# EAGLE design PB_LAN9500 (EAGLE 7.7.0)

## Sheet 1 of 3
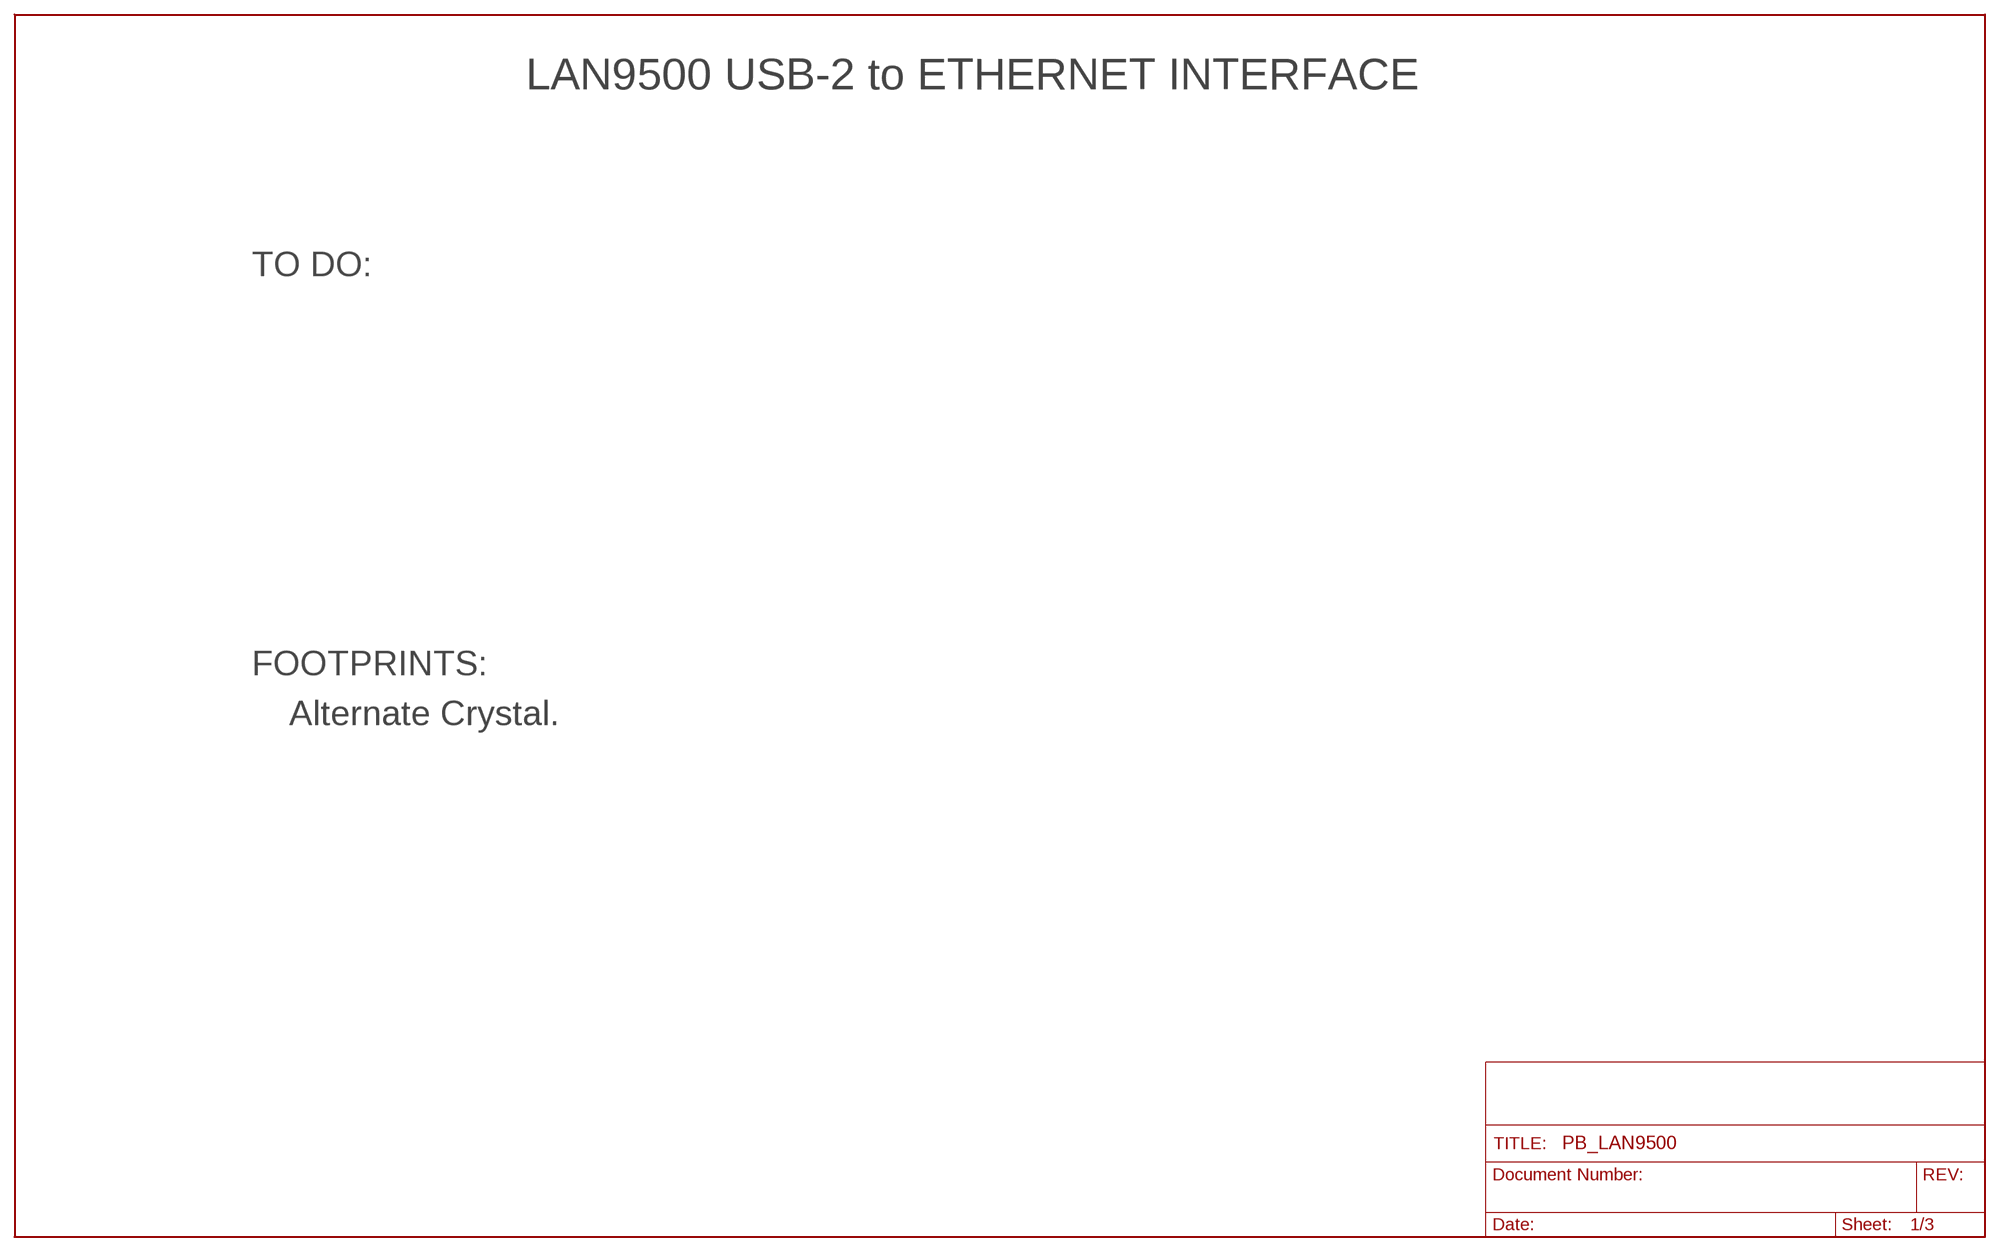
[diagram p0: schematic, sheet 1]

### Notes on the sheet
- LAN9500 USB-2 to ETHERNET INTERFACE
- TO DO:
- FOOTPRINTS:
- Alternate Crystal.

## Sheet 2 of 3
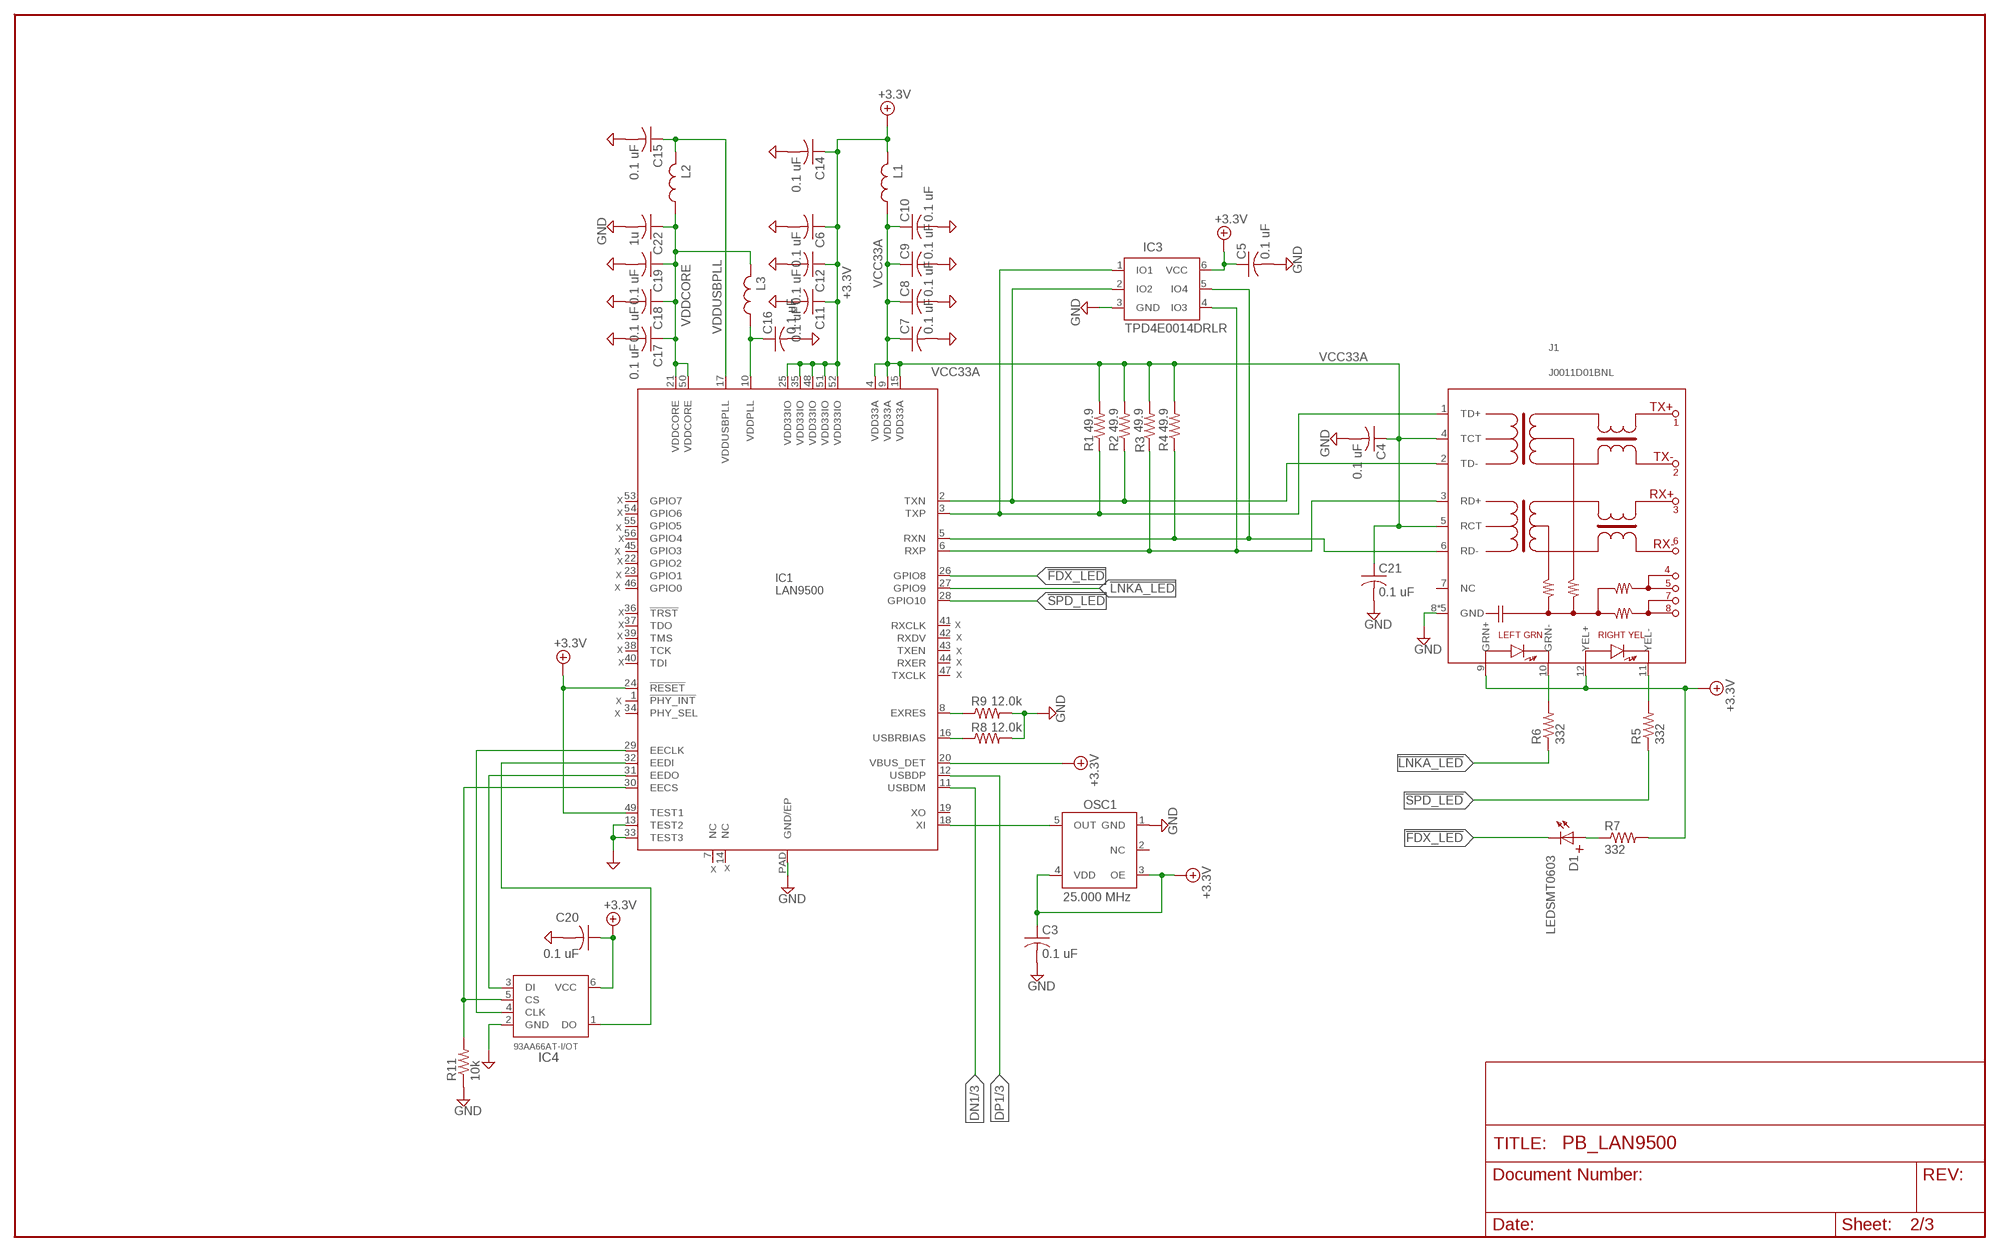
[diagram p1: schematic, sheet 2]

### Parts
C3  0.1 uF  C-USC0402  [C0402]
C4  0.1 uF  C-USC0402  [C0402]
C5  0.1 uF  C-USC0402  [C0402]
C6  0.1 uF  C-USC0402  [C0402]
C7  0.1 uF  C-USC0402  [C0402]
C8  0.1 uF  C-USC0402  [C0402]
C9  0.1 uF  C-USC0402  [C0402]
C10  0.1 uF  C-USC0402  [C0402]
C11  0.1 uF  C-USC0402  [C0402]
C12  0.1 uF  C-USC0402  [C0402]
C14  0.1 uF  C-USC0402  [C0402]
C15  0.1 uF  C-USC0402  [C0402]
C16  0.1 uF  C-USC0402  [C0402]
C17  0.1 uF  C-USC0402  [C0402]
C18  0.1 uF  C-USC0402  [C0402]
C19  0.1 uF  C-USC0402  [C0402]
C20  0.1 uF  C-USC0402  [C0402]
C21  0.1 uF  C-USC0402  [C0402]
C22  1u  C-USC0805  [C0805]
D1  LEDSMT0603  [LED0603]
IC1  LAN9500  [QFN56]
IC3  TPD4E0014DRLR  [SOT-553-6]
IC4  93AA66AT-I/OT  [SOT23-6]
J1  J0011D01BNL  [J0011D01BNL]
L1  L0603AS  [L0603AS]
L2  L0603AS  [L0603AS]
L3  L0603AS  [L0603AS]
OSC1  25.000 MHz  SIT2024B  [SOT23-5]
R1  49.9  R-US_R0603  [R0603]
R2  49.9  R-US_R0603  [R0603]
R3  49.9  R-US_R0603  [R0603]
R4  49.9  R-US_R0603  [R0603]
R5  332  R-US_R0603  [R0603]
R6  332  R-US_R0603  [R0603]
R7  332  R-US_R0603  [R0603]
R8  12.0k  R-US_R0603  [R0603]
R9  12.0k  R-US_R0603  [R0603]
R11  10k  R-US_R0603  [R0603]

### Nets
!FDX_LED: D1.P$2(K) IC1.26(GPIO8)
!LNKA_LED: IC1.27(GPIO9) R6.1
!SPD_LED: IC1.28(GPIO10) R5.1
+3.3V: C3.1 C5.1 C6.1 C11.1 C12.1 C14.1 C20.1 IC1.20(VBUS_DET) IC1.24(!RESET) IC1.25(VDD33IO) IC1.35(VDD33IO) IC1.48(VDD33IO) IC1.49(TEST1) IC1.51(VDD33IO) IC1.52(VDD33IO) IC3.6(VCC) IC4.6(VCC) J1.9(GRN+) J1.12(YEL+) L1.2 OSC1.3(OE) OSC1.4(VDD) R7.2 ; also sheet 3
DN1: IC1.11(USBDM) ; also sheet 3
DP1: IC1.12(USBDP) ; also sheet 3
GND: C3.2 C4.2 C5.2 C6.2 C7.2 C8.2 C9.2 C10.2 C11.2 C12.2 C14.2 C15.2 C16.2 C17.2 C18.2 C19.2 C20.2 C21.2 C22.2 IC1.13(TEST2) IC1.33(TEST3) IC1.PAD(GND/EP) IC3.3(GND) IC4.2(GND) J1.8(GND) J1.GND1(GND) J1.GND2(GND) J1.GND3(GND) J1.GND4(GND) OSC1.1(GND) R8.2 R9.2 R11.1 ; also sheet 3
N$3: J1.11(YEL-) R5.2
N$5: IC1.30(EECS) IC4.5(CS) R11.2
N$6: IC1.29(EECLK) IC4.4(CLK)
N$7: IC1.31(EEDO) IC4.3(DI)
N$8: IC1.32(EEDI) IC4.1(DO)
N$9: IC1.8(EXRES) R9.1
N$10: IC1.16(USBRBIAS) R8.1
N$14: D1.P$1(A) R7.1
N$18: J1.10(GRN-) R6.2
N$22: IC1.18(XI) OSC1.5(OUT)
RXN: IC1.5(RXN) IC3.5(IO4) J1.6(RD-) R4.1
RXP: IC1.6(RXP) IC3.4(IO3) J1.3(RD+) R3.1
TXN: IC1.2(TXN) IC3.2(IO2) J1.2(TD-) R2.1
TXP: IC1.3(TXP) IC3.1(IO1) J1.1(TD+) R1.1
VCC33A: C4.1 C7.1 C8.1 C9.1 C10.1 C21.1 IC1.4(VDD33A) IC1.9(VDD33A) IC1.15(VDD33A) J1.4(TCT) J1.5(RCT) L1.1 R1.2 R2.2 R3.2 R4.2
VDDCORE: C17.1 C18.1 C19.1 C22.1 IC1.21(VDDCORE) IC1.50(VDDCORE) L2.1 L3.2
VDDPLL: C16.1 IC1.10(VDDPLL) L3.1
VDDUSBPLL: C15.1 IC1.17(VDDUSBPLL) L2.2
Unconnected: IC1.1(!PHY_INT) IC1.7(NC) IC1.14(NC) IC1.19(XO) IC1.22(GPIO2) IC1.23(GPIO1) IC1.34(PHY_SEL) IC1.36(!TRST) IC1.37(TDO) IC1.38(TCK) IC1.39(TMS) IC1.40(TDI) IC1.41(RXCLK) IC1.42(RXDV) IC1.43(TXEN) IC1.44(RXER) IC1.45(GPIO3) IC1.46(GPIO0) IC1.47(TXCLK) IC1.53(GPIO7) IC1.54(GPIO6) IC1.55(GPIO5) IC1.56(GPIO4) J1.7(NC) OSC1.2(NC)

### Notes on the sheet
- X
- X
- X
- X
- X
- X
- X
- X
- X
- X | X
- X | X
- X | X
- X | X
- X
- X
- X
- X | X

## Sheet 3 of 3
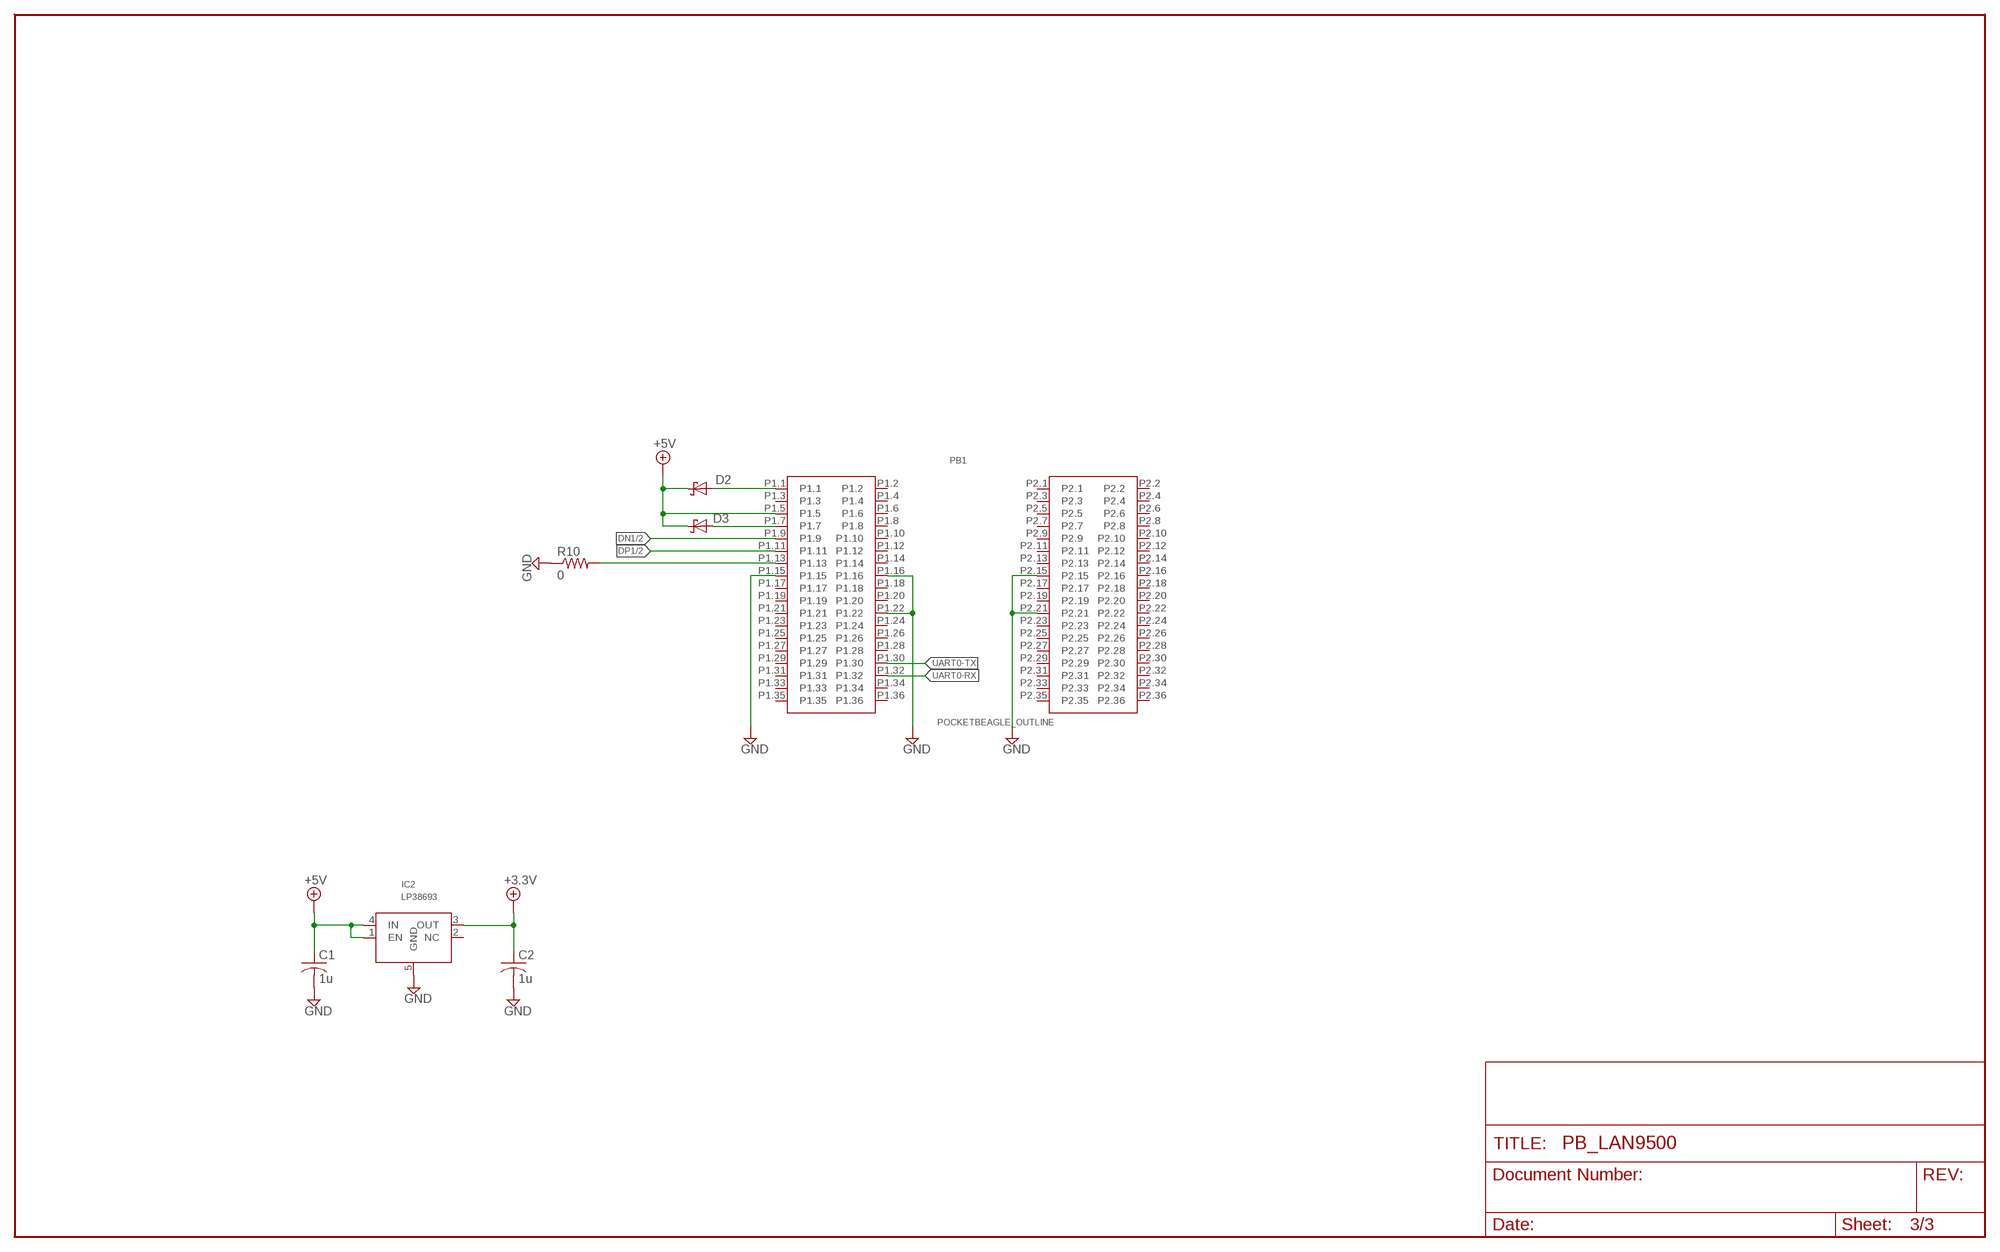
[diagram p2: schematic, sheet 3]

### Parts
C1  1u  C-USC0805  [C0805]
C2  1u  C-USC0805  [C0805]
D2  MBRAF1540  [SMA-FL]
D3  MBRAF1540  [SMA-FL]
IC2  LP38693  [SOT-223-4]
PB1  POCKETBEAGLE_OUTLINE  [PB_OUTLINE]
R10  0  R-US_R0603  [R0603]

### Nets
+3.3V: C2.1 IC2.3(OUT) ; also sheet 2
+5V: C1.1 D2.C D3.C IC2.1(EN) IC2.4(IN) PB1.P1.5
DN1: PB1.P1.9 ; also sheet 2
DP1: PB1.P1.11 ; also sheet 2
GND: C1.2 C2.2 IC2.5(GND) PB1.P1.15 PB1.P1.16 PB1.P1.22 PB1.P2.15 PB1.P2.21 R10.1 ; also sheet 2
ID1: PB1.P1.13 R10.2
N$1: D3.A PB1.P1.7
N$2: D2.A PB1.P1.1
UART0-RX: PB1.P1.32
UART0-TX: PB1.P1.30
Unconnected: IC2.2(NC) PB1.P1.2 PB1.P1.3 PB1.P1.4 PB1.P1.6 PB1.P1.8 PB1.P1.10 PB1.P1.12 PB1.P1.14 PB1.P1.17 PB1.P1.18 PB1.P1.19 PB1.P1.20 PB1.P1.21 PB1.P1.23 PB1.P1.24 PB1.P1.25 PB1.P1.26 PB1.P1.27 PB1.P1.28 PB1.P1.29 PB1.P1.31 PB1.P1.33 PB1.P1.34 PB1.P1.35 PB1.P1.36 PB1.P2.1 PB1.P2.2 PB1.P2.3 PB1.P2.4 PB1.P2.5 PB1.P2.6 PB1.P2.7 PB1.P2.8 PB1.P2.9 PB1.P2.10 PB1.P2.11 PB1.P2.12 PB1.P2.13 PB1.P2.14 PB1.P2.16 PB1.P2.17 PB1.P2.18 PB1.P2.19 PB1.P2.20 PB1.P2.22 PB1.P2.23 PB1.P2.24 PB1.P2.25 PB1.P2.26 PB1.P2.27 PB1.P2.28 PB1.P2.29 PB1.P2.30 PB1.P2.31 PB1.P2.32 PB1.P2.33 PB1.P2.34 PB1.P2.35 PB1.P2.36

## Library data of the parts
C1-C12 C14-C22 = 0G_RCL:C-US: CAPACITOR, American symbol
D1 = 0G_LED_TVS:LED: LiteOn LEDS, SMT 0805, 0603, T-1 Leaded Package
D2 D3 = 0G_Diode:MBRAF1540: ON Semiconductor MBRAF1540 Schottky
IC1 = 0G_Ethernet:LAN9500: MICROCHIO SMSC LAN9500 USB-2 TO ETHERNET 10/100b
IC2 = 0G_Regulators:LP38693: TI LP38693 Fixed Voltage LDO, SOT-223 Package
IC3 = 0G_Ethernet:TPD4E001: TI Low-Capacitance +/- 15 kV ESD Protection Array for High Speed Data Interfaces
IC4 = 0G_Ethernet:93AA66A
J1 = 0G_Ethernet:J0011D01BNL: PulseJack J0011D01BNL Ethernet Connector with internal magnetics
L1-L3 = 0G_Ethernet:L0603AS: 0603AS sized chip inductors
OSC1 = 0G_Oscillators:SIT2024B: SiTime SOT23 Oscillator
PB1 = 0G_PockletBeagle:POCKETBEAGLE_OUTLINE: PocketBeagle Outline and IO Connectors, Unlabled
R1-R11 = 0G_Passives:R-US_: RESISTOR, American symbol

## Board
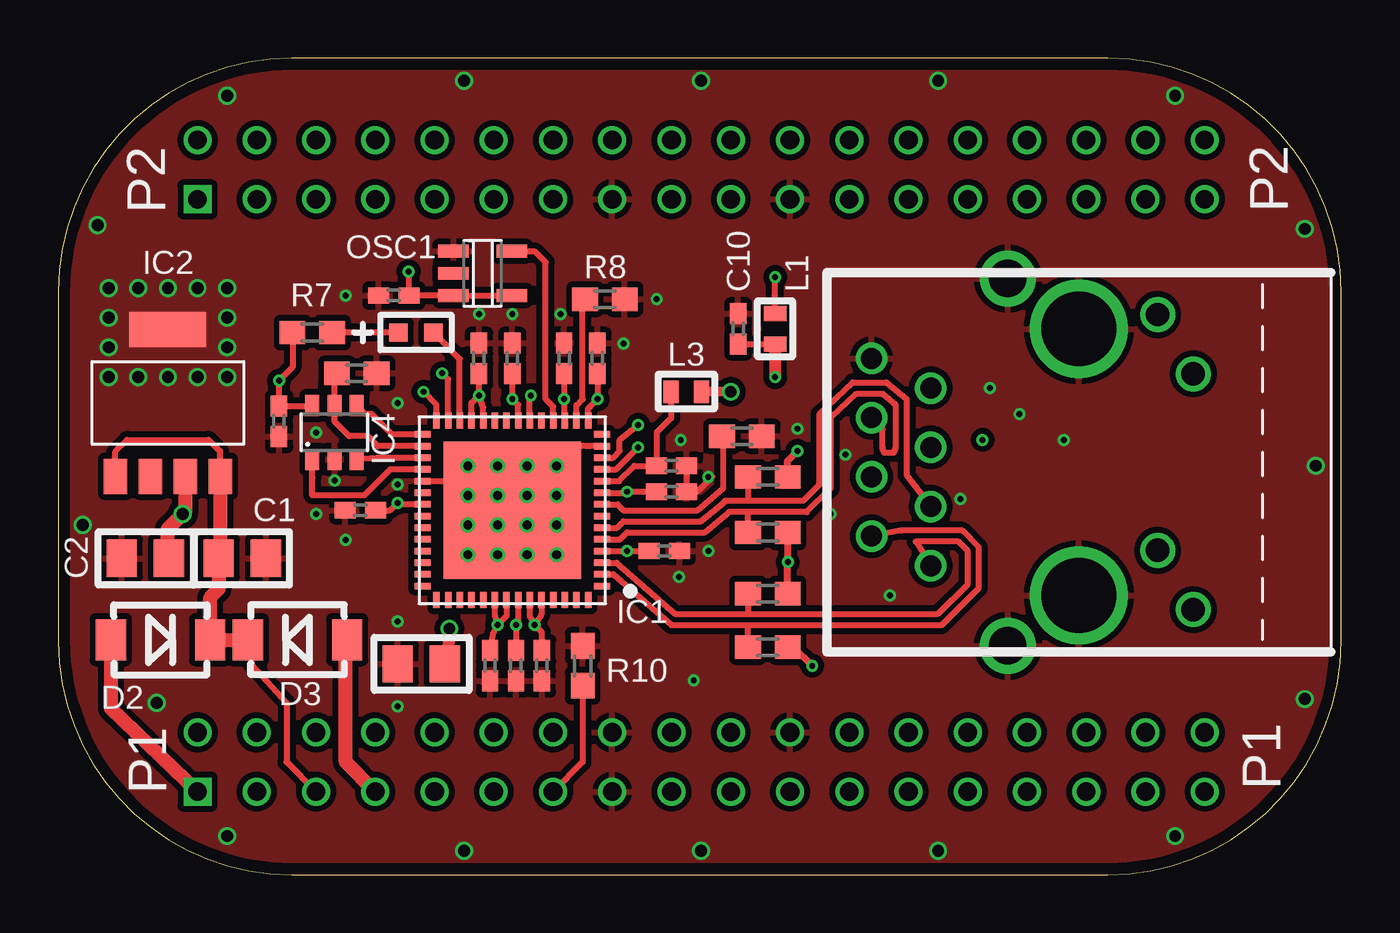
[diagram p3: board, top side]
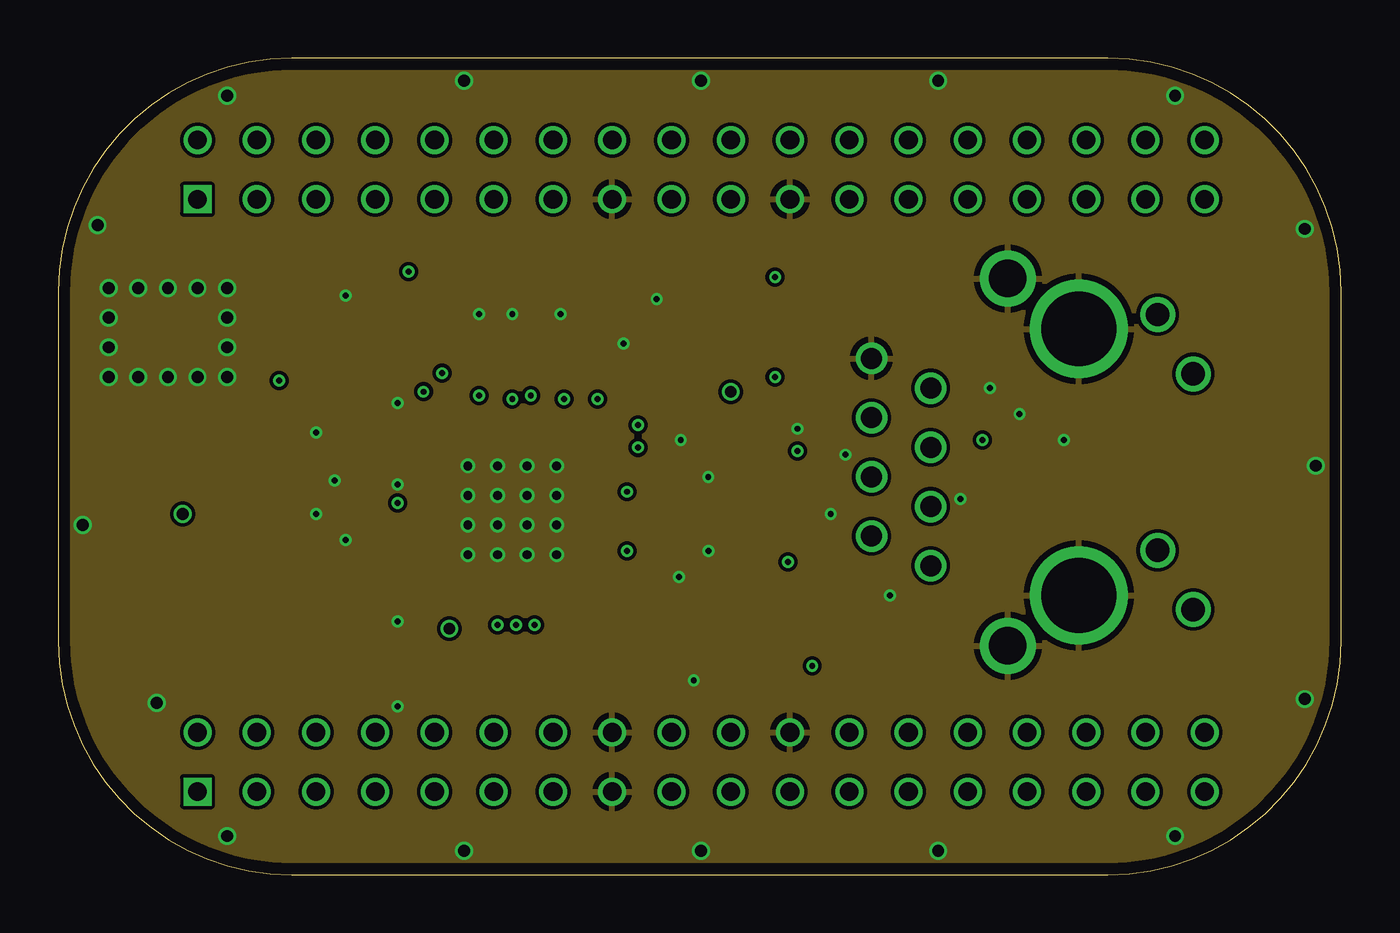
[diagram p4: board, inner layer GND]
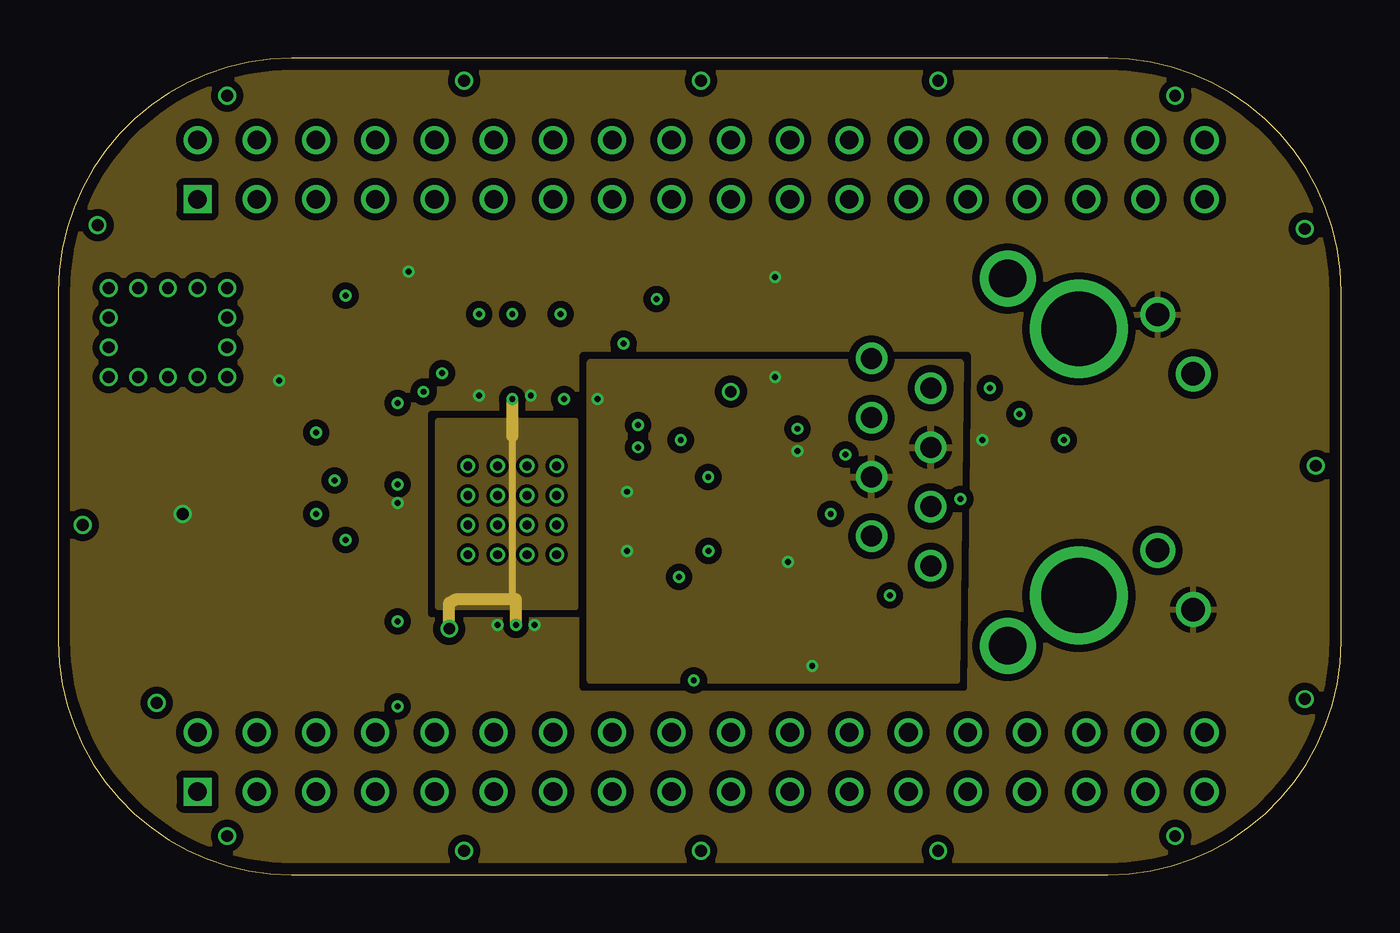
[diagram p5: board, inner layer POWER]
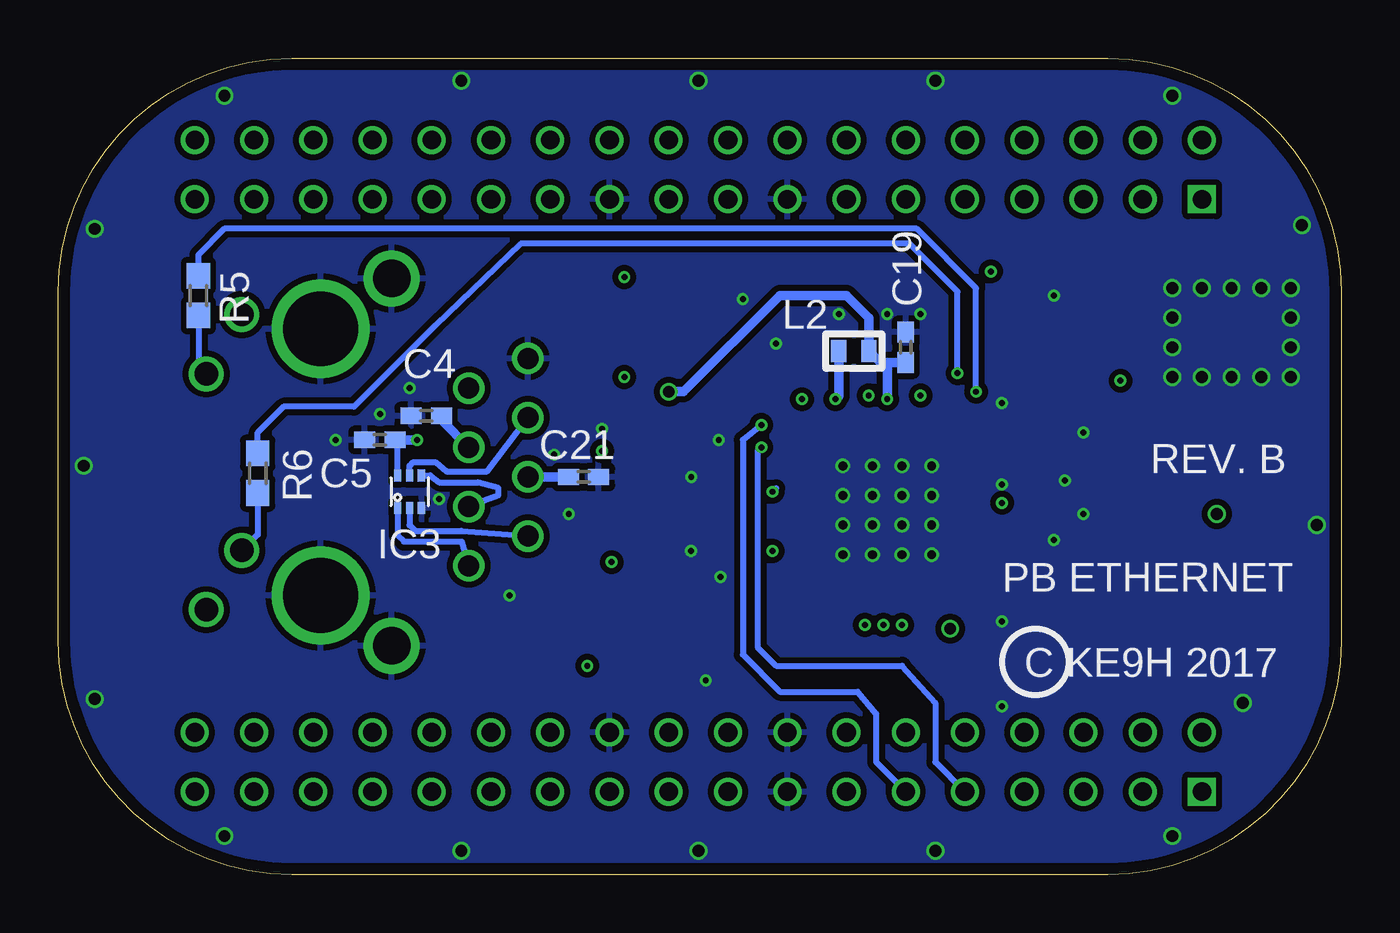
[diagram p6: board, bottom side, seen from below]

Size 55 x 35 mm. Coordinates in mm from the lower left corner, seen from the top.
Copper layers (1*2+15*16): TOP 0.035mm / dielectric 0.16mm / GND 0.035mm / dielectric 1.2mm / POWER 0.035mm / dielectric 0.16mm / BOTTOM 0.035mm
Design rules "default *": minimum track width 8mil, minimum drill 10mil, track to track 6mil, track to pad 6mil, pad to pad 6mil, via to via 6mil, smd to smd 6mil, copper to edge 20mil, drill to drill 8mil, minimum pad ring 5mil, minimum via ring 5mil, stop-mask expansion 4mil, vias tented up to drill 0mil, thermal gap 10mil
tRestrict: area 16.3,15.1 to 16.6,16.1; area 22.3,15.1 to 22.6,16.1; area 19,18.5 to 19.9,18.8; area 19,12.4 to 19.9,12.8

### Footprints (pad centres in the part's own frame; a part is rotated, then mirrored left to right if it is on the bottom)
C0805 = smd 1.295 x 1.6: 1 -1.001,0; 2 1.026,0
C0402 = smd 0.9 x 0.7: 1 -0.65,0; 2 0.65,0
LED0603 = smd 0.787 x 0.787: P$1 -0.749,0; P$2 0.749,0
SMA-FL = smd 1.3 x 1.76: A -2.13,0; C 2.13,0
QFN56 = smd 0.28 x 0.69: 1 -3.25,-3.845; 2 -2.75,-3.845; 3 -2.25,-3.845; 4 -1.75,-3.845; 5 -1.25,-3.845; 6 -0.75,-3.845; 7 -0.25,-3.845; 8 0.25,-3.845; 9 0.75,-3.845; 10 1.25,-3.845; 11 1.75,-3.845; 12 2.25,-3.845; 13 2.75,-3.845; 14 3.25,-3.845; 29 3.25,3.845; 30 2.75,3.845; 31 2.25,3.845; 32 1.75,3.845; 33 1.25,3.845; 34 0.75,3.845; 35 0.25,3.845; 36 -0.25,3.845; 37 -0.75,3.845; 38 -1.25,3.845; 39 -1.75,3.845; 40 -2.25,3.845; 41 -2.75,3.845; 42 -3.25,3.845 | smd 0.69 x 0.28: 15 3.845,-3.25; 16 3.845,-2.75; 17 3.845,-2.25; 18 3.845,-1.75; 19 3.845,-1.25; 20 3.845,-0.75; 21 3.845,-0.25; 22 3.845,0.25; 23 3.845,0.75; 24 3.845,1.25; 25 3.845,1.75; 26 3.845,2.25; 27 3.845,2.75; 28 3.845,3.25; 43 -3.845,3.25; 44 -3.845,2.75; 45 -3.845,2.25; 46 -3.845,1.75; 47 -3.845,1.25; 48 -3.845,0.75; 49 -3.845,0.25; 50 -3.845,-0.25; 51 -3.845,-0.75; 52 -3.845,-1.25; 53 -3.845,-1.75; 54 -3.845,-2.25; 55 -3.845,-2.75; 56 -3.845,-3.25 | smd 5.9 x 5.9: PAD 0,0
SOT-223-4 = smd 1 x 1.5: 1 -2.25,-3.15; 2 -0.75,-3.15; 3 0.75,-3.15; 4 2.25,-3.15 | smd 3.3 x 1.5: 5 0,3.15
SOT-553-6 = smd 0.305 x 0.508: 1 -0.508,-0.699; 2 0,-0.699; 3 0.508,-0.699; 4 0.508,0.699; 5 0,0.699; 6 -0.508,0.699
SOT23-6 = smd 0.6 x 0.9: 1 -0.95,-1.15; 2 0,-1.15; 3 0.95,-1.15; 4 0.95,1.15; 5 0,1.15; 6 -0.95,1.15
J0011D01BNL = drill 0.9: 1 4.445,-6.35; 2 3.175,-8.89; 3 1.905,-6.35; 4 0.635,-8.89; 5 -0.635,-6.35; 6 -1.905,-8.89; 7 -3.175,-6.35; 8 -4.445,-8.89 | drill 1: 9 6.325,4.902; 10 3.785,3.378; 11 -3.785,4.902; 12 -6.325,3.378 | drill 3.2: GND1 5.715,0; GND2 -5.715,0 | drill 1.6: GND3 7.874,-3.048; GND4 -7.874,-3.048
L0603AS = smd 0.65 x 0.95: 1 -0.65,0; 2 0.65,0
SOT23-5 = smd 0.55 x 1.3: 1 -0.95,-1.25; 2 0,-1.25; 3 0.95,-1.25; 4 0.95,1.25; 5 -0.95,1.25
PB_OUTLINE = drill 0.8 square: P1.1 -21.59,-13.97; P2.1 -21.59,11.43 | drill 0.8: P1.2 -21.59,-11.43; P1.3 -19.05,-13.97; P1.4 -19.05,-11.43; P1.5 -16.51,-13.97; P1.6 -16.51,-11.43; P1.7 -13.97,-13.97; P1.8 -13.97,-11.43; P1.9 -11.43,-13.97; P1.10 -11.43,-11.43; P1.11 -8.89,-13.97; P1.12 -8.89,-11.43; P1.13 -6.35,-13.97; P1.14 -6.35,-11.43; P1.15 -3.81,-13.97; P1.16 -3.81,-11.43; P1.17 -1.27,-13.97; P1.18 -1.27,-11.43; P1.19 1.27,-13.97; P1.20 1.27,-11.43; P1.21 3.81,-13.97; P1.22 3.81,-11.43; P1.23 6.35,-13.97; P1.24 6.35,-11.43; P1.25 8.89,-13.97; P1.26 8.89,-11.43; P1.27 11.43,-13.97; P1.28 11.43,-11.43; P1.29 13.97,-13.97; P1.30 13.97,-11.43; P1.31 16.51,-13.97; P1.32 16.51,-11.43; P1.33 19.05,-13.97; P1.34 19.05,-11.43; P1.35 21.59,-13.97; P1.36 21.59,-11.43; P2.2 -21.59,13.97; P2.3 -19.05,11.43; P2.4 -19.05,13.97; P2.5 -16.51,11.43; P2.6 -16.51,13.97; P2.7 -13.97,11.43; P2.8 -13.97,13.97; P2.9 -11.43,11.43; P2.10 -11.43,13.97; P2.11 -8.89,11.43; P2.12 -8.89,13.97; P2.13 -6.35,11.43; P2.14 -6.35,13.97; P2.15 -3.81,11.43; P2.16 -3.81,13.97; P2.17 -1.27,11.43; P2.18 -1.27,13.97; P2.19 1.27,11.43; P2.20 1.27,13.97; P2.21 3.81,11.43; P2.22 3.81,13.97; P2.23 6.35,11.43; P2.24 6.35,13.97; P2.25 8.89,11.43; P2.26 8.89,13.97; P2.27 11.43,11.43; P2.28 11.43,13.97; P2.29 13.97,11.43; P2.30 13.97,13.97; P2.31 16.51,11.43; P2.32 16.51,13.97; P2.33 19.05,11.43; P2.34 19.05,13.97; P2.35 21.59,11.43; P2.36 21.59,13.97
R0603 = smd 1.1 x 1: 1 -0.85,0; 2 0.85,0

### Placement (x,y rotation side)
C1  7.87,13.56 0 top
C2  3.75,13.56 180 top
C3  14.38,24.83 180 top
C4  39.23,19.67 180 bottom
C5  41.21,18.64 180 bottom
C6  18.51,8.95 270 top
C7  25.97,13.87 0 top
C8  26.29,16.41 0 top
C9  23.11,22.13 90 top
C10  29.15,23.4 90 top
C11  20.73,8.95 270 top
C12  12.95,15.62 180 top
C14  18.03,22.13 90 top
C15  21.69,22.13 90 top
C16  26.29,17.53 0 top
C17  19.62,8.95 270 top
C18  19.46,22.13 90 top
C19  18.67,22.61 90 bottom
C20  9.46,19.43 270 top
C21  32.48,17.05 0 bottom
C22  15.57,9.03 180 top
D1  15.34,23.24 0 top
D2  4.38,10.06 0 top
D3  10.26,10.06 180 top
IC1  19.46,15.62 90 top
IC2  4.7,20.22 0 top
IC3  39.94,16.41 0 bottom
IC4  11.84,18.95 0 top
J1  43.75,17.68 270 top
L1  30.73,23.4 90 top
L2  20.89,22.45 180 bottom
L3  26.92,20.7 0 top
OSC1  18.19,25.78 270 top
PB1  27.56,17.53 0 top
R1  30.42,12.05 0 top
R2  30.42,9.75 0 top
R3  30.42,17.05 0 top
R4  30.42,14.67 0 top
R5  48.99,24.83 270 bottom
R6  46.45,17.21 270 bottom
R7  10.89,23.24 180 top
R8  23.43,24.67 0 top
R9  29.31,18.8 0 top
R10  22.48,8.95 270 top
R11  12.8,21.49 180 top

### Tracks (layer width: path | path; a pad name or v marks a point on that pad's centre or on a via)
!FDX_LED
  TOP 0.254: IC1.26 17.21,22.11 D1.P$2
!LNKA_LED  (via drill 0.25)
  TOP 0.254: IC1.27 16.71,21.23 v16.45,21.49
  BOTTOM 0.254: v16.45,21.49 16.45,24.99 18.51,27.05 35.18,27.05 38.83,23.56 42.32,20.07 45.34,20.07 46.45,18.95 R6.1
!SPD_LED  (via drill 0.25)
  TOP 0.254: IC1.28 16.21,20.14 v15.65,20.7
  BOTTOM 0.254: v15.65,20.7 15.65,25.15 18.19,27.69 47.88,27.69 48.99,26.57 R5.1
+3.3V  (via drill 0.25, 0.51)
  TOP 0.254: 10.25,23.24 R7.2 10.04,21.76 v9.46,21.18 C20.1 10.87,20.08 IC4.6 | OSC1.4 OSC1.3 C3.1 15.02,24.84 v15.02,25.86 | IC1.35 14.77,15.87 v14.54,15.94 14.22,15.62 C12.1 | IC1.25 17.71,20.22 v18.03,20.54 | IC1.24 18.21,20.05 v18.03,20.54 | IC1.20 20.21,20.34 v20.26,20.54 | IC1.48 18.71,11.13 v18.83,10.7 | IC1.51 20.21,11.06 v20.41,10.7 | IC1.52 20.71,11.16 v20.41,10.7 | C11.1 20.73,10.38 v20.41,10.7 | C6.1 18.67,10.38 v18.83,10.7 | IC1.49 19.21,11.08 v18.83,10.7 | L1.2 v30.73,25.62 | v18.03,20.54 C14.1
  TOP 0.61: IC2.3 5.45,15.58 v5.33,15.46 4.7,14.83 4.7,13.83
  TOP 0.813: 4.7,13.83 C2.1
  BOTTOM 0.254: IC3.6 40.45,18.52 C5.1
  BOTTOM 0.406: C5.1 v39.62,18.64
  pour POWER (isolate 0.305, rank 2): -0.38,-0.25 -0.38,35.31 55.5,35.31 55.5,-0.25
+5V
  TOP 0.254: D3.C 8.28,9.02 9.78,7.37 9.78,4.83 PB1.P1.5 | IC2.1 2.45,18.13 2.95,18.64 6.44,18.64 6.92,18.16 6.92,17.1 IC2.4
  TOP 0.305: 6.6,17.1 IC2.4
  TOP 0.61: D3.C D2.C 6.51,11.88 6.87,12.24 C1.1 | 6.51,13.51 C1.1 | IC2.4 6.95,13.63 C1.1
  TOP 0.813: 6.63,13.63 C1.1
DN1  (via drill 0.25)
  TOP 0.254: IC1.11 23.91,17.37 v24.86,18.32
  BOTTOM 0.254: v24.86,18.32 25.02,18.16 25.02,9.75 24.23,8.95 18.83,8.95 17.4,7.37 17.4,4.83 PB1.P1.9
DP1  (via drill 0.25)
  TOP 0.254: IC1.12 23.78,17.87 24.07,18.16 24.07,18.64 v24.86,19.27
  BOTTOM 0.254: v24.86,19.27 25.65,18.64 25.65,9.43 24.07,7.84 20.73,7.84 19.94,6.89 19.94,4.83 PB1.P1.11
GND  (via drill 0.25, 0.38, 0.51)
  TOP 0.254: IC1.33 18.21,16.87 v17.56,16.26 | IC1.13 22.21,18.37 v21.37,17.53 | C16.2 C8.2 | 26.92,16.41 27.4,16.41 28.04,17.05
  TOP 0.508: v18.83,14.99 IC1.PAD
  other vias: 2.16,25.15 11.84,16.89 20.1,16.26 18.83,17.53 17.56,14.99 17.56,13.72 18.83,13.72 21.37,13.72 26.61,12.76 11.05,18.95 26.69,18.64 27.88,13.87 20.1,17.53 18.83,16.26 20.1,13.72 20.1,14.99 21.37,14.99 21.37,16.26 17.56,17.53 14.54,16.73 3.43,25.15 4.7,25.15 5.97,25.15 7.24,25.15 7.24,23.88 7.24,22.61 7.24,21.34 5.97,21.34 4.7,21.34 3.43,21.34 2.16,21.34 2.16,22.61 2.16,23.88 1.05,14.99 4.22,7.37 7.24,1.65 17.4,1.02 27.56,1.02 37.72,1.02 47.88,1.65 53.44,7.52 53.91,17.53 53.44,27.69 47.88,33.4 37.72,34.04 27.56,34.04 17.4,34.04 7.24,33.4 1.68,27.84 12.32,24.83 14.54,20.22 12.32,14.35 11.05,15.46 18.03,24.03 19.46,24.03 21.53,24.03 24.23,22.76 25.65,24.67 27.86,17.05 33.12,15.46 43.12,18.64 41.21,19.75 39.94,20.86 14.54,10.86 14.54,7.21 27.24,8.32 38.67,16.1 33.75,18 31.69,19.11 35.66,11.97
  pour BOTTOM (isolate 0.254): -0.38,-0.25 -0.38,35.31 55.5,35.31 55.5,-0.25
  pour TOP (isolate 0.254): -0.38,-0.25 -0.38,35.31 55.5,35.31 55.5,-0.25
  pour GND: -0.38,-0.25 -0.38,35.31 55.5,35.31 55.5,-0.25
ID1
  TOP 0.254: PB1.P1.13 22.48,4.83 R10.2
N$1
  TOP 0.61: PB1.P1.7 12.32,4.83 12.32,10 D3.A
N$2
  TOP 0.61: D2.A 2.25,7.11 PB1.P1.1
N$3
  BOTTOM 0.254: R5.2 48.99,21.81 J1.11
N$5
  TOP 0.254: IC1.30 13.7,18.37 13.27,18.8 12.48,18.8 11.84,19.43 IC4.5 11.84,21.39 R11.2
N$6
  TOP 0.254: IC1.29 14.31,18.87 13.43,19.75 13.15,19.75 IC4.4
N$7
  TOP 0.254: IC1.31 13.65,17.87 IC4.3
N$8
  TOP 0.254: IC1.32 14.23,17.37 13.11,16.26 10.89,16.26 10.89,17.01 IC4.1
N$9
  TOP 0.254: IC1.8 23.98,15.87 24.23,15.62 27.4,15.62 28.51,16.57 28.51,18.54 R9.1
N$10
  TOP 0.254: IC1.16 22.21,20.12 22.48,20.38 22.48,24.57 R8.1
N$14
  TOP 0.254: D1.P$1 R7.1
N$18
  BOTTOM 0.254: R6.2 46.45,14.58 J1.10
N$22
  TOP 0.254: IC1.18 21.21,20.06 20.89,20.38 20.89,26.26 20.42,26.73 OSC1.5
RXN
  TOP 0.254: IC1.5 24.09,14.37 24.38,14.67 27.72,14.67 27.74,14.69 28.67,15.46 28.75,15.54 29.62,15.54 | 29.62,15.54 32.08,15.54 33.12,16.57 33.12,19.59 34.23,20.62 35.34,20.62 35.89,20.14 35.89,18.32 35.81,18.08 35.42,18.08 35.34,18.32 35.34,19.11 J1.6 | R4.1 29.57,15.48 29.62,15.54
  BOTTOM 0.254: IC3.5 39.94,17.53 39.78,17.68 38.83,17.68 38.35,17.29 36.61,17.29 J1.6
RXP
  TOP 0.254: IC1.6 23.95,14.87 24.23,15.14 27.56,15.14 27.6,15.19 28.51,15.94 28.59,16.02 29.62,16.02 | 29.62,16.02 31.92,16.02 32.64,16.73 32.64,19.75 34.07,21.1 35.5,21.1 36.37,20.38 36.37,17.13 J1.3 | R3.1 29.57,16.07 29.62,16.02
  BOTTOM 0.254: IC3.4 39.05,17.11 38.67,16.81 37.01,16.81 36.13,16.57 36.13,16.26 J1.3
TXN
  TOP 0.254: IC1.2 23.8,12.87 26.29,10.7 29.62,10.7 | 29.62,10.7 37.88,10.7 39.46,12.29 39.46,14.03 38.75,14.75 36.13,14.75 J1.2 | R2.1 29.57,10.64 29.62,10.7
  BOTTOM 0.254: IC3.2 39.94,14.99 39.69,14.73 37.71,14.73 J1.2
TXP
  TOP 0.254: IC1.3 23.93,13.37 26.45,11.18 29.62,11.18 | 29.62,11.18 37.72,11.18 38.99,12.45 38.99,13.87 38.59,14.27 36.77,14.27 J1.1 | R1.1 29.57,11.23 29.62,11.18
  BOTTOM 0.254: IC3.1 40.45,14.54 40.18,14.27 37.71,14.27 J1.1
VCC33A  (via drill 0.25)
  TOP 0.254: IC1.9 24.18,16.37 v24.38,16.41 C8.1 | IC1.4 24.06,13.87 v24.38,13.87 C7.1 | C9.1 v23.11,20.38 | v23.11,20.38 22.8,20.07 | IC1.15 22.71,19.98 v23.11,20.38 | C10.1 L1.1
  TOP 0.305: R3.2 31.27,17.74 v31.69,18.16 | R4.2 31.27,13.5 v31.28,13.4 31.27,13.3 R1.2 | R2.2 31.53,9.75 v32.32,8.95
  TOP 0.508: 31.53,9.49 R2.2 | L1.1 v30.73,21.34
  BOTTOM 0.254: v24.38,16.41 24.23,16.57
  BOTTOM 0.406: C21.1 J1.4 | C4.1 38.58,19.49 J1.5
  pour POWER (isolate 0.305): 22.8,21.97 38.67,21.97 38.51,8.32 22.8,8.32
VDDCORE  (via drill 0.25, 0.51)
  TOP 0.254: IC1.50 19.71,10.79 v19.62,10.7 C17.1 | C18.1 v19.46,20.38 19.71,20.13 IC1.21
  TOP 0.406: L3.2 v28.83,20.7
  TOP 0.508: C22.1 16.73,9.24 v16.76,10.54
  POWER 0.305: 19.46,18.8 19.46,11.81
  POWER 0.508: v19.46,20.38 19.46,18.8 | v19.62,10.7 19.62,11.81 19.46,11.81 17.08,11.81 16.76,11.65 v16.76,10.54
  BOTTOM 0.406: C19.1 19.62,21.96 | 19.62,21.96 19.75,21.96 L2.1 20.24,23.86 21.21,24.83 24.07,24.83 28.19,20.7 v28.83,20.7 | v19.46,20.38 19.46,21.8 19.62,21.96
  pour POWER: 22.16,19.43 16.29,19.43 16.29,11.49 22.16,11.49
VDDPLL
  TOP 0.254: IC1.10 24.05,16.87 24.7,17.53 C16.1 25.65,17.38 25.65,18.95 26.27,19.57 L3.1
VDDUSBPLL  (via drill 0.25)
  TOP 0.254: C15.1 v21.68,20.38 21.68,19.49 IC1.17
  BOTTOM 0.406: L2.2 21.54,20.53 v21.68,20.38

### Text on the board
bPlace: REV. B | PB ETHERNET | C KE9H 2017